# EAGLE design amp_shield_v2.3 (EAGLE 7.2.0)
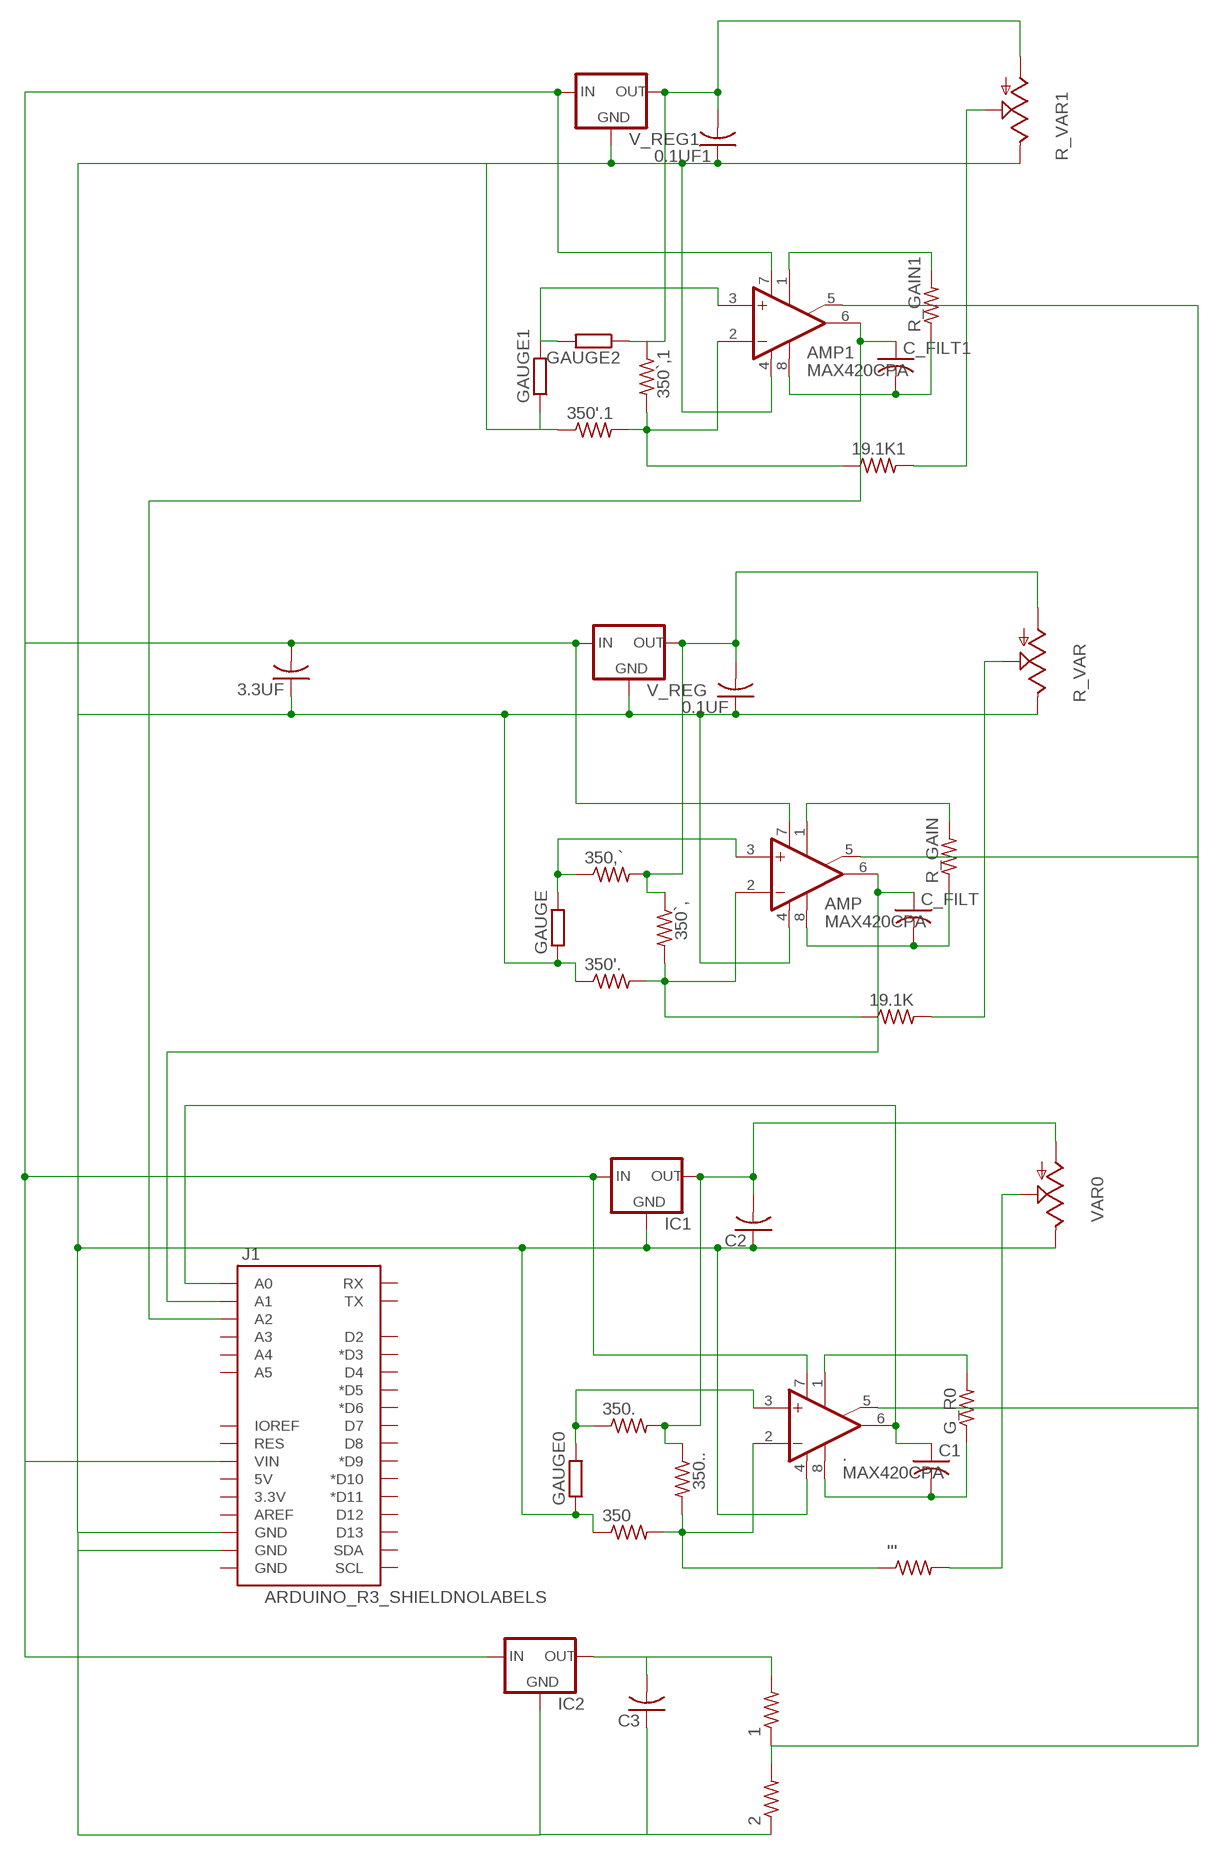
[diagram p0: schematic, sheet 1]

## Parts
0.1UF  C-US025-024X044  [C025-024X044]
0.1UF1  C-US025-024X044  [C025-024X044]
1  R-US_0204/2V  [0204V]
2  R-US_0204/2V  [0204V]
3.3UF  C-US025-024X044  [C025-024X044]
19.1K  R-US_0204/2V  [0204V]
19.1K1  R-US_0204/2V  [0204V]
350  R-US_0204/2V  [0204V]
350'.  R-US_0204/2V  [0204V]
350'.1  R-US_0204/2V  [0204V]
350,`  R-US_0204/2V  [0204V]
350.  R-US_0204/2V  [0204V]
350..  R-US_0204/2V  [0204V]
350`,  R-US_0204/2V  [0204V]
350`,1  R-US_0204/2V  [0204V]
'''  R-US_0204/2V  [0204V]
.  MAX420CPA  [DIL08]
AMP  MAX420CPA  [DIL08]
AMP1  MAX420CPA  [DIL08]
C1  C-US025-024X044  [C025-024X044]
C2  C-US025-024X044  [C025-024X044]
C3  C-US025-024X044  [C025-024X044]
C_FILT  C-US025-024X044  [C025-024X044]
C_FILT1  C-US025-024X044  [C025-024X044]
G_R0  R-US_0204/2V  [0204V]
GAUGE  R-EU_0204/2V  [0204V]
GAUGE0  R-EU_0204/2V  [0204V]
GAUGE1  R-EU_0204/2V  [0204V]
GAUGE2  R-EU_0204/2V  [0204V]
IC1  78MXXS  [78MXXS]
IC2  78MXXS  [78MXXS]
J1  ARDUINO_R3_SHIELDNOLABELS  [UNO_R3_SHIELD_NOLABELS]
R_GAIN  R-US_0204/2V  [0204V]
R_GAIN1  R-US_0204/2V  [0204V]
R_VAR  TRIM_US-B64Y  [B64Y]
R_VAR1  TRIM_US-B64Y  [B64Y]
V_REG  78MXXS  [78MXXS]
V_REG1  78MXXS  [78MXXS]
VAR0  TRIM_US-B64Y  [B64Y]

## Nets
0.1UF1: 0.1UF1.1 0.1UF.1 2.1 3.3UF.1 350'.1.1 350'..1 350.1 ..4(V-) AMP1.4(V-) AMP.4(V-) C2.1 C3.1 GAUGE0.1 GAUGE1.1 GAUGE.1 IC1.GND IC2.GND J1.GND@1(GND) J1.GND@2(GND) R_VAR1.E R_VAR.E V_REG1.GND V_REG.GND VAR0.E
350.: 350..1 ..3(+IN) GAUGE0.2
N$2: 0.1UF.2 350,`.2 350`,.1 R_VAR.A V_REG.OUT
N$3: '''.2 VAR0.S
N$4: 350..2 350...1 C2.2 IC1.OUT VAR0.A
N$5: ..1(CEXTA) G_R0.2
N$6: ..8(CEXTB) C1.2 G_R0.1
N$7: ..6(OUT) C1.1 J1.A0
N$8: 350.2 350...2 '''.1 ..2(-IN)
N$9: AMP.8(CEXTB) C_FILT.2 R_GAIN.1
N$10: AMP1.8(CEXTB) C_FILT1.2 R_GAIN1.1
N$11: AMP.1(CEXTA) R_GAIN.2
N$12: AMP.6(OUT) C_FILT.1 J1.A1
N$13: 19.1K.1 350'..2 350`,.2 AMP.2(-IN)
N$14: 350,`.1 AMP.3(+IN) GAUGE.2
N$15: 19.1K.2 R_VAR.S
N$16: AMP1.1(CEXTA) R_GAIN1.2
N$17: AMP1.6(OUT) C_FILT1.1 J1.A2
N$18: 19.1K1.1 350'.1.2 350`,1.2 AMP1.2(-IN)
N$19: AMP1.3(+IN) GAUGE1.2 GAUGE2.2
N$20: 19.1K1.2 R_VAR1.S
N$21: 0.1UF1.2 350`,1.1 GAUGE2.1 R_VAR1.A V_REG1.OUT
N$22: 1.2 C3.2 IC2.OUT
N$23: 1.1 2.2 ..5(CRETN) AMP1.5(CRETN) AMP.5(CRETN)
V_REG1: 3.3UF.2 ..7(V+) AMP1.7(V+) AMP.7(V+) IC1.IN IC2.IN J1.VIN V_REG1.IN V_REG.IN
Unconnected: J1.3.3V J1.5V J1.A3 J1.A4 J1.A5 J1.AREF J1.D2 J1.D3(*D3) J1.D4 J1.D5(*D5) J1.D6(*D6) J1.D7 J1.D8 J1.D9(*D9) J1.D10(*D10) J1.D11(*D11) J1.D12 J1.D13 J1.GND@0(GND) J1.IOREF J1.RES J1.RX J1.SCL J1.SDA J1.TX

## Library data of the parts
0.1UF 0.1UF1 3.3UF C1-C3 C_FILT C_FILT1 = adafruit:C-US: CAPACITOR, American symbol
1 2 19.1K 19.1K1 350 350'. 350'.1 350,` 350. 350.. 350`, 350`,1 ''' G_R0 R_GAIN R_GAIN1 = adafruit:R-US_: RESISTOR, American symbol
. AMP AMP1 = maxim:MAX420CPA: OP AMP; OC_FARNELL: unknown; OC_NEWARK: unknown
GAUGE GAUGE0 GAUGE1 GAUGE2 = rcl:R-EU_: RESISTOR, European symbol
IC1 IC2 V_REG V_REG1 = v-reg:78MXXS: VOLTAGE REGULATOR
J1 = SparkFun-Boards:ARDUINO_R3_SHIELD: Shield form compatible with the Arduino Uno R3.
R_VAR R_VAR1 VAR0 = pot:TRIM_US-: POTENTIOMETER

## Board
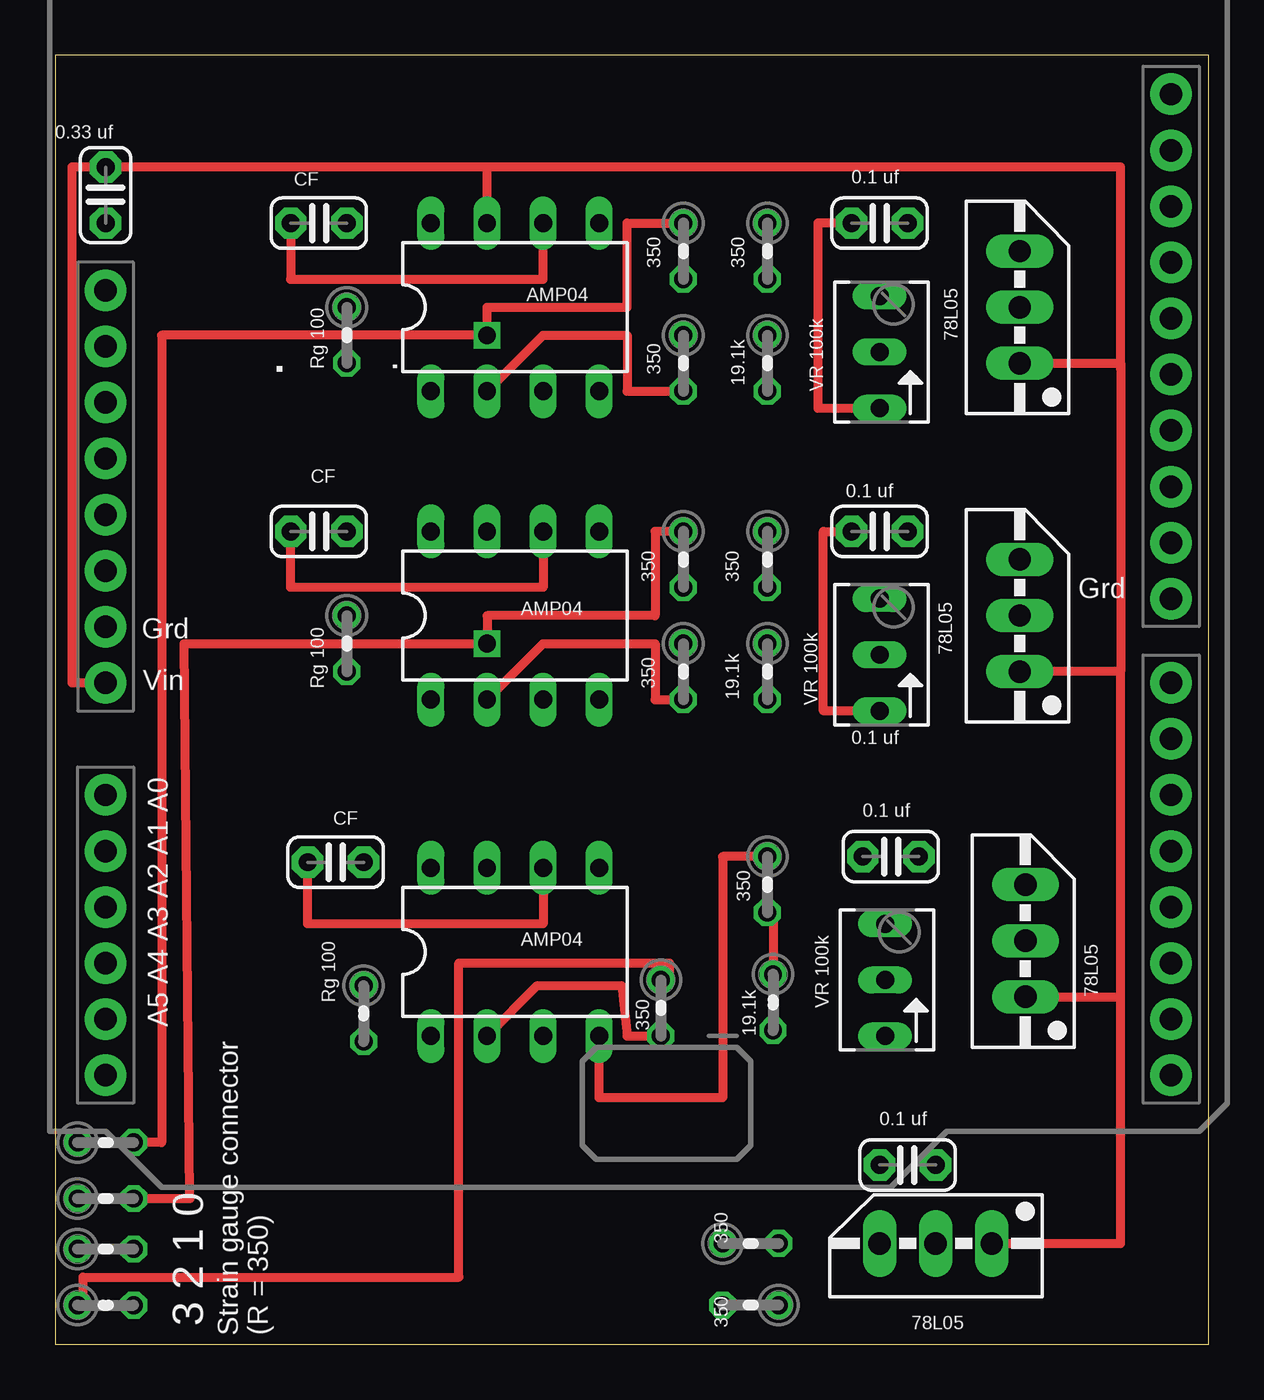
[diagram p1: board, top side]
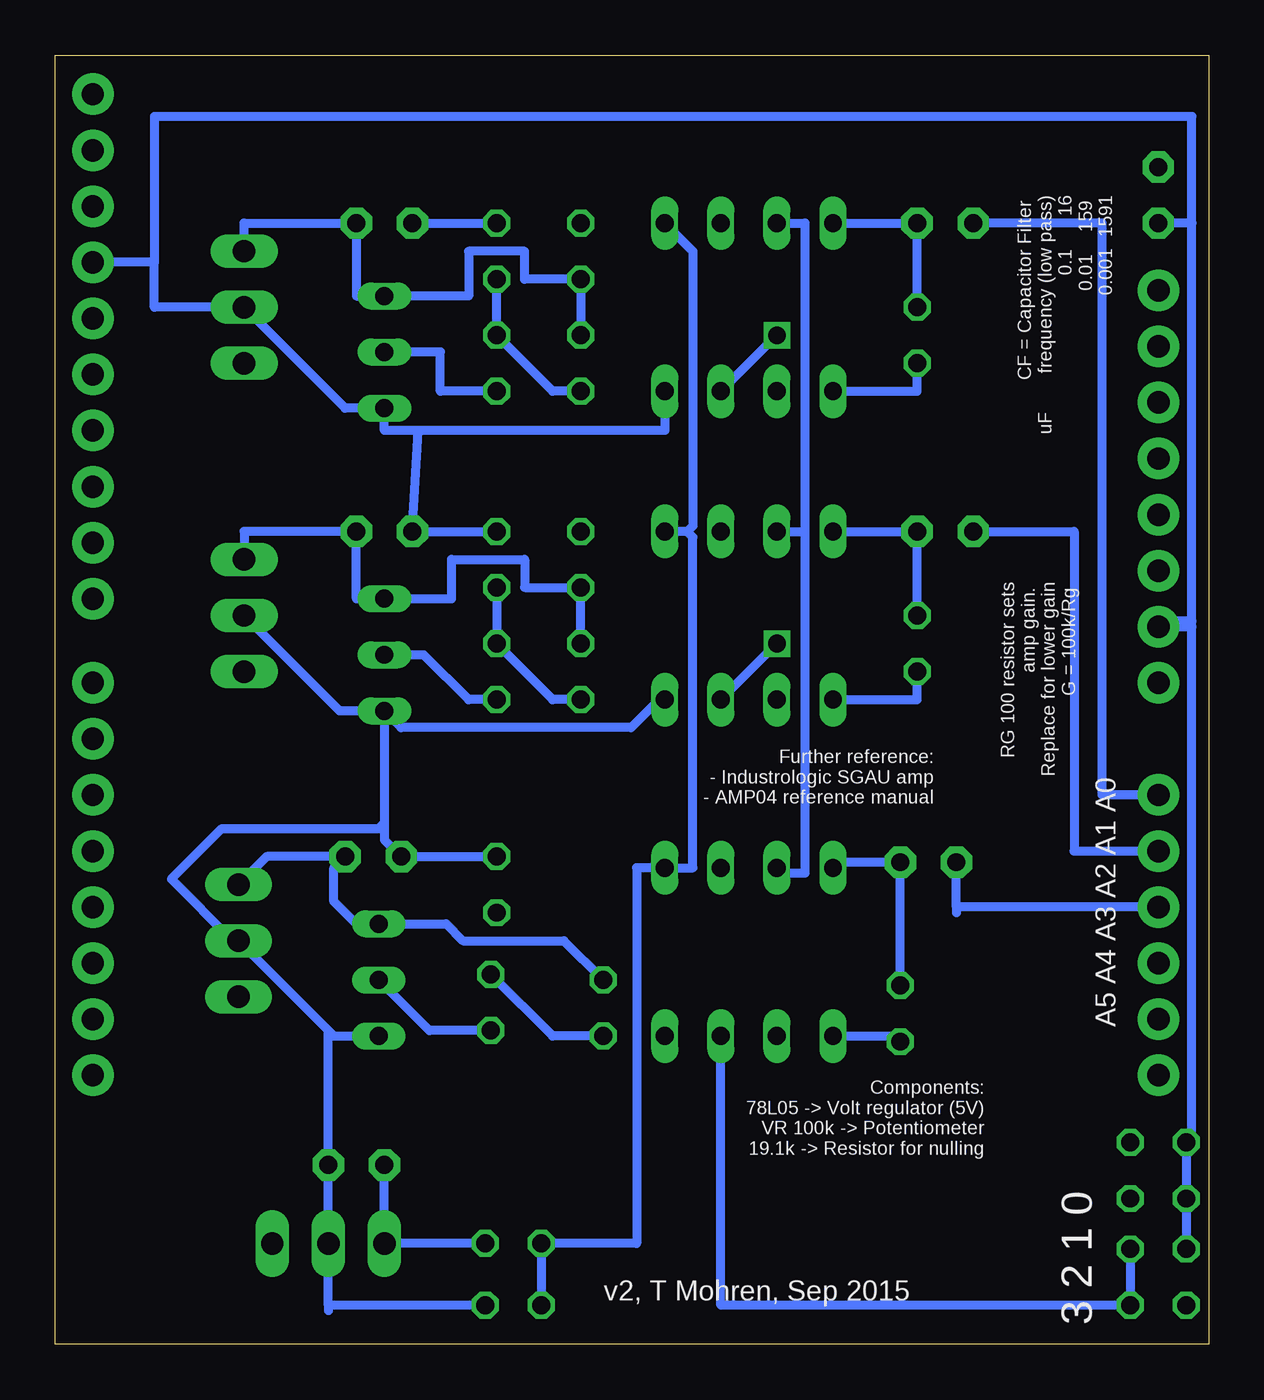
[diagram p2: board, bottom side, seen from below]

Size 52.25 x 58.41 mm. Coordinates in mm from the lower left corner, seen from the top.
Outline: 0,0 52.25,0 52.25,58.41 0,58.41 0,0
Copper layers (1*16): Top 0.0356mm / dielectric 1.5011mm / Bottom 0.0356mm
Design rules "LaenPCBOrder": minimum track width 6mil, minimum drill 13mil, track to track 6mil, track to pad 6mil, pad to pad 6mil, via to via 6mil, smd to smd 6mil, copper to edge 15mil, drill to drill 6mil, minimum pad ring 7mil, minimum via ring 7mil, stop-mask expansion 3mil, vias tented up to drill 0mil, thermal gap 10mil

### Footprints (pad centres in the part's own frame; a part is rotated, then mirrored left to right if it is on the bottom)
C025-024X044 = drill 0.813 pad 1.422 octagon: 1 -1.27,0; 2 1.27,0
0204V = drill 0.813 octagon: 1 -1.27,0; 2 1.27,0
DIL08 = drill 0.813 long: 1 -3.81,-3.81; 2 -1.27,-3.81; 3 1.27,-3.81; 4 3.81,-3.81; 5 3.81,3.81; 6 1.27,3.81; 7 -1.27,3.81; 8 -3.81,3.81
78MXXS = drill 1.016 long: GND 0,-2.54; IN -2.54,-2.54; OUT 2.54,-2.54
UNO_R3_SHIELD_NOLABELS = drill 1.016 pad 1.88: 3.3V 50.8,26.67; 5V 50.8,29.21; A0 50.8,41.91; A1 50.8,44.45; A2 50.8,46.99; A3 50.8,49.53; A4 50.8,52.07; A5 50.8,54.61; AREF 2.54,15.24; D2 2.54,49.53; D3 2.54,46.99; D4 2.54,44.45; D5 2.54,41.91; D6 2.54,39.37; D7 2.54,36.83; D8 2.54,33.02; D9 2.54,30.48; D10 2.54,27.94; D11 2.54,25.4; D12 2.54,22.86; D13 2.54,20.32; GND@0 50.8,31.75; GND@1 50.8,34.29; GND@2 2.54,17.78; IOREF 50.8,21.59; NC 50.8,19.05; RES 50.8,24.13; RX 2.54,54.61; SCL 2.54,10.16; SDA 2.54,12.7; TX 2.54,52.07; VIN 50.8,36.83
B64Y = drill 0.813 long: A 2.54,0; E -2.54,0; S 0,0

### Placement (x,y rotation side)
0.1UF  37.34,36.83 0 top
0.1UF1  37.85,22.1 0 top
1  31.5,4.57 0 top
2  31.5,1.78 180 top
3.3UF  2.29,52.07 90 top
19.1K  32.26,30.48 270 top
19.1K1  32.51,15.49 270 top
350  32.26,49.53 270 top
350'.  32.26,35.56 270 top
350'.1  32.26,20.83 270 top
350,`  28.45,35.56 270 top
350.  28.45,49.53 270 top
350..  28.45,44.45 270 top
350`,  28.45,30.48 270 top
350`,1  27.43,15.24 270 top
'''  32.26,44.45 270 top
.  20.83,46.99 0 top
AMP  20.83,33.02 0 top
AMP1  20.83,17.78 0 top
C1  11.94,50.8 0 top
C2  37.34,50.8 0 top
C3  38.61,8.13 180 top
C_FILT  11.94,36.83 0 top
C_FILT1  12.7,21.84 0 top
G_R0  13.21,45.72 270 top
GAUGE  2.29,6.6 0 top
GAUGE0  2.29,9.14 0 top
GAUGE1  2.29,4.32 0 top
GAUGE2  2.29,1.78 0 top
IC1  41.15,46.99 90 top
IC2  39.88,2.03 180 top
J1  53.09,66.8 180 top
R_GAIN  13.21,31.75 270 top
R_GAIN1  13.97,14.99 270 top
R_VAR  37.34,31.24 90 top
R_VAR1  37.59,16.51 90 top
V_REG  41.15,33.02 90 top
V_REG1  41.4,18.29 90 top
VAR0  37.34,44.96 90 top

### Tracks (layer width: path | path; a pad name or v marks a point on that pad's centre or on a via)
0.1UF1
  Top 0.406: C2.1 34.54,50.8 34.54,42.42 VAR0.E | 350'.1.1 30.23,22.1 30.23,11.18 24.64,11.18 AMP1.4 | R_VAR.E 34.8,28.7 34.8,36.83 0.1UF.1
  Bottom 0.406: R_VAR.E 39.37,28.7 V_REG.GND | 39.88,14.22 39.62,13.97 R_VAR1.E | 39.88,14.22 V_REG1.GND 44.2,18.29 46.99,21.08 44.7,23.37 37.59,23.37 37.34,23.62 | R_VAR.E 37.34,23.62 | 37.34,23.62 37.34,22.86 0.1UF1.1 350'.1.1 | 35.81,41.4 0.1UF.1 350'..1 | C2.1 350.1 | AMP.4 24.89,29.21 26.16,27.94 36.58,27.94 R_VAR.E | GAUGE1.1 GAUGE.1 GAUGE0.1 0.76,9.14 0.76,32.77 2.29,32.77 J1.GND@1 0.76,32.51 0.76,50.8 | 0.76,50.8 3.3UF.1 | ..4 24.64,41.4 35.81,41.4 | 35.81,41.4 37.34,41.4 VAR0.E 39.12,42.42 IC1.GND 47.75,46.99 47.75,49.02 | 0.76,50.8 0.76,55.63 47.75,55.63 47.75,49.02 | 50.55,48.77 J1.GND@2 47.75,49.02 | 2.1 39.88,1.78 | 39.88,1.78 39.88,1.52 | 39.88,1.78 IC2.GND C3.1 39.88,14.22
350.  (via drill 0.8)
  Top 0.406: GAUGE0.2 4.83,9.14 4.83,45.72 v19.56,45.72 19.56,46.99 25.91,46.99 25.91,50.8 350..1
  Bottom 0.406: v19.56,45.72 ..3
N$2
  Bottom 0.406: 350`,.1 350,`.2 30.99,34.29 30.99,35.56 34.29,35.56 34.29,33.78 R_VAR.A 38.61,33.78 0.1UF.2 43.69,36.83 V_REG.OUT
N$3
  Bottom 0.406: '''.2 34.8,43.18 34.8,44.96 VAR0.S
N$4
  Bottom 0.406: 350...1 350..2 30.99,48.26 30.99,49.53 33.53,49.53 33.53,47.5 VAR0.A 38.61,47.5 C2.2 43.69,50.8 IC1.OUT
N$5
  Bottom 0.406: ..1 13.21,43.18 G_R0.2
N$6
  Bottom 0.406: G_R0.1 C1.2 ..8
N$7
  Top 0.406: C1.1 10.67,48.26 22.1,48.26 ..6
  Bottom 0.406: J1.A0 4.83,24.89 4.83,50.8 C1.1
N$8
  Top 0.406: 350...2 25.91,43.18 25.91,45.72 22.1,45.72 ..2
  Bottom 0.406: 350...2 29.72,43.18 '''.1 350.2
N$9
  Bottom 0.406: R_GAIN.1 C_FILT.2 AMP.8
N$10
  Bottom 0.406: R_GAIN1.1 C_FILT1.2 17.02,21.84 AMP1.8
N$11
  Bottom 0.406: AMP.1 13.21,29.21 R_GAIN.2
N$12
  Top 0.406: AMP.6 22.1,34.29 10.67,34.29 C_FILT.1
  Bottom 0.406: C_FILT.1 6.1,36.83 6.1,22.35 J1.A1
N$13
  Top 0.406: 350`,.2 27.18,29.21 27.18,31.75 22.1,31.75 AMP.2
  Bottom 0.406: 350`,.2 29.72,29.21 19.1K.1 350'..2
N$14  (via drill 0.8)
  Top 0.406: GAUGE.2 6.1,6.6 5.84,31.75 v19.56,31.75 19.56,33.02 27.18,33.02 27.18,36.83 350,`.1
  Bottom 0.406: v19.56,31.75 AMP.3
N$15
  Bottom 0.406: 19.1K.2 33.53,29.21 35.56,31.24 R_VAR.S
N$16
  Bottom 0.406: AMP1.1 13.97,13.97 R_GAIN1.2
N$17
  Top 0.406: AMP1.6 22.1,19.05 11.43,19.05 C_FILT1.1
  Bottom 0.406: J1.A2 11.43,19.81 | 11.43,19.81 11.43,19.56 | 11.43,19.81 C_FILT1.1
N$18
  Top 0.406: AMP1.2 21.84,16.26 25.65,16.26 25.91,13.97 350`,1.2 | 350'.1.2 32.51,19.56 19.1K1.1
  Bottom 0.406: 350`,1.2 29.72,13.97 19.1K1.1
N$19
  Bottom 0.406: GAUGE1.2 GAUGE2.2 22.1,1.78 AMP1.3
N$20
  Bottom 0.406: 19.1K1.2 35.31,14.22 R_VAR1.S
N$21
  Top 0.406: GAUGE2.1 1.27,1.78 1.27,3.05 18.29,3.05 18.29,17.27 27.81,17.27 27.81,16.89 27.43,16.89 350`,1.1
  Bottom 0.406: 350`,1.1 29.21,18.29 33.78,18.29 34.54,19.05 R_VAR1.A 38.61,19.05 39.62,20.07 39.62,21.59 0.1UF1.2 42.67,22.1 V_REG1.OUT
N$22
  Bottom 0.406: 1.2 IC2.OUT C3.2
N$23
  Bottom 0.406: ..5 23.37,49.53 23.37,37.08 23.62,36.83 | 23.62,36.83 AMP.5 | 23.62,36.83 23.37,36.58 23.37,21.59 AMP1.5 25.91,21.59 25.91,4.57 1.1 2.2
V_REG1
  Top 0.406: J1.VIN 0.76,29.97 0.76,53.34 3.3UF.2 19.56,53.34 | 48.26,44.45 48.27,41.92 48.26,30.48 | 48.26,30.48 V_REG.IN | V_REG1.IN 48.26,15.75 | 48.26,15.75 48.26,30.48 | 48.26,15.75 48.26,4.57 IC2.IN | 48.26,44.2 48.26,44.45 | 48.26,44.45 48.26,53.34 19.56,53.34 | IC1.IN 48.26,44.45 | ..7 19.56,53.34
  Bottom 0.406: ..7 18.29,50.8 18.29,36.83 | 18.29,36.83 18.29,21.34 19.56,21.34 AMP1.7 | AMP.7 18.29,36.83

### Text on the board
tPlace: 0.33 uf | CF | 0.1 uf | 350 | 350 | AMP04 | 78L05 | Rg 100 | 350 | 19.1k | VR 100k | CF | 0.1 uf | 350 | 350 | AMP04 | Grd | Grd | 78L05 | Vin | Rg 100 | 350 | 19.1k | VR 100k | 0.1 uf | A5 A4 A3 A2 A1 A0 | CF | 0.1 uf | 350 | AMP04 | Arduino 3-channel / strain gauge amp shield | Rg 100 | VR 100k | 78L05 | 350 | 19.1k | 0.1 uf | 350 | 3 2 1 0 | 78L05 | Strain gauge connector / (R = 350) | 350
bPlace: CF = Capacitor Filter / uF frequency (low pass) / 0.1 16 / 0.01 159 / 0.001 1591 | RG 100 resistor sets / amp gain. / Replace for lower gain / G = 100k/Rg | Further reference: / - Industrologic SGAU amp / - AMP04 reference manual | A5 A4 A3 A2 A1 A0 | Components: / 78L05 -> Volt regulator (5V) / VR 100k -> Potentiometer / 19.1k -> Resistor for nulling | v2, T Mohren, Sep 2015 | 3 2 1 0